# EAGLE design Camera (EAGLE 8.3.2)
COMPANY: ADAFRUIT INDUSTRIES; DRAWN: KTOWN; REV: A
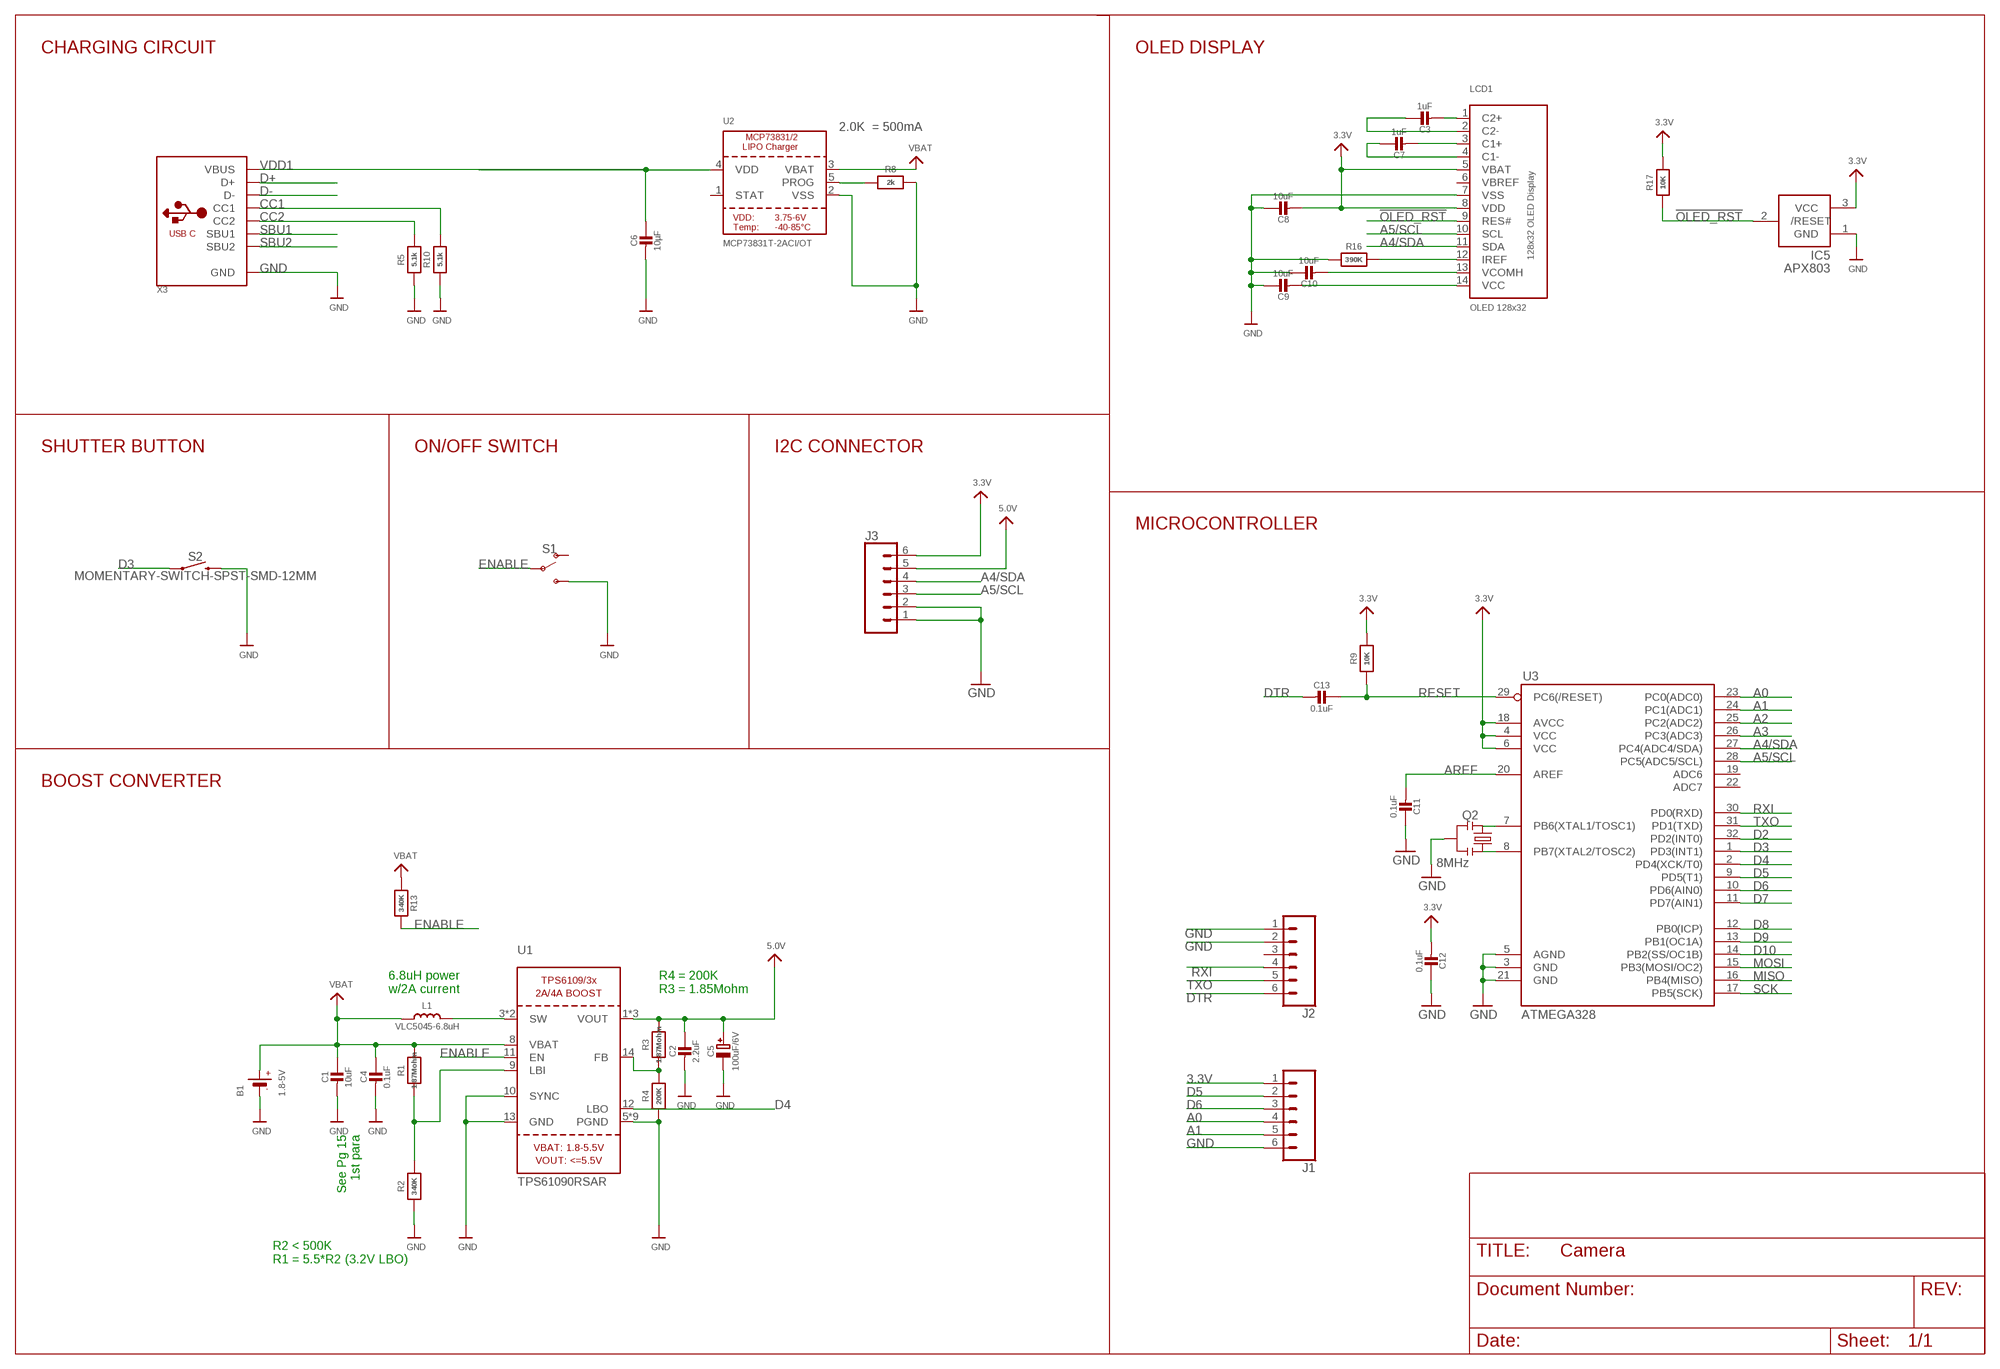
[diagram p0: schematic, sheet 1]

## Parts
B1  1.8-5V  BATTERY  [JSTPH2]
C1  10uF  CAP_CERAMIC0805-NOOUTLINE  [0805-NO]
C2  2.2uF  CAP_CERAMIC0805-NOOUTLINE  [0805-NO]
C3  1uF  CAP_CERAMIC0805-NOOUTLINE  [0805-NO]
C4  0.1uF  CAP_CERAMIC0805-NOOUTLINE  [0805-NO]
C5  100uF/6V  CAP_TANTALUMB/3528_REFLOW  [EIA3528-21/B-R]
C6  10µF  CAP_CERAMIC0805-NOOUTLINE  [0805-NO]
C7  1uF  CAP_CERAMIC0805-NOOUTLINE  [0805-NO]
C8  10uF  CAP_CERAMIC0805-NOOUTLINE  [0805-NO]
C9  10uF  CAP_CERAMIC0805-NOOUTLINE  [0805-NO]
C10  10uF  CAP_CERAMIC0805-NOOUTLINE  [0805-NO]
C11  0.1uF  CAP_CERAMIC0805-NOOUTLINE  [0805-NO]
C12  0.1uF  CAP_CERAMIC0805-NOOUTLINE  [0805-NO]
C13  0.1uF  CAP_CERAMIC0805-NOOUTLINE  [0805-NO]
IC5  APX803  AXP083-SAG  [SOT23]
J1  CONN_06SMD-FEMALE-V2  [1X06-SMD-FEMALE]
J2  CONN_06SMD-FEMALE-V2  [1X06-SMD-FEMALE]
J3  CONN_06SMD-FEMALE-V2  [1X06-SMD-FEMALE]
L1  VLC5045-6.8uH  INDUCTORTDK_VLC5045  [INDUCTOR_5X5MM_TDK_VLC5045]
LCD1  OLED 128x32  DISP_OLED_UG-2832HSWEG02  [UG-2832HSWEG02_WRAPUNDER]
Q2  8MHz  RESONATORSMD  [RESONATOR-SMD]
R1  1.87Mohm  RESISTOR0805_NOOUTLINE  [0805-NO]
R2  340K  RESISTOR0805_NOOUTLINE  [0805-NO]
R3  1.87Mohm  RESISTOR0805_NOOUTLINE  [0805-NO]
R4  200K  RESISTOR0805_NOOUTLINE  [0805-NO]
R5  5.1k  RESISTOR0805_NOOUTLINE  [0805-NO]
R8  2k  RESISTOR0805_NOOUTLINE  [0805-NO]
R9  10K  RESISTOR0805_NOOUTLINE  [0805-NO]
R10  5.1k  RESISTOR0805_NOOUTLINE  [0805-NO]
R13  340K  RESISTOR0805_NOOUTLINE  [0805-NO]
R16  390K  RESISTOR0805_NOOUTLINE  [0805-NO]
R17  10K  RESISTOR0805_NOOUTLINE  [0805-NO]
S1  SWITCH-SPDT-SMD-RIGHT-ANGLE  [SWITCH_SPST_SMD_A]
S2  MOMENTARY-SWITCH-SPST-SMD-12MM  [TACTILE_SWITCH_SMD_12MM]
U1  TPS61090RSAR  VREG_TPS6103X  [PVQFN-16]
U2  MCP73831T-2ACI/OT  MCP73831/2  [SOT23-5]
U3  ATMEGA328  ATMEGA168  [TQFP32-08]
X3  USB_C  [USB_C_CUSB31-CFM2AX-01-X]

## Nets
3.3V: C8.2 C12.2 IC5.3(VCC) J1.1 J3.6 LCD1.5(VBAT) LCD1.8(VDD) R9.2 R17.2 U3.4(VCC) U3.6(VCC) U3.18(AVCC)
5.0V: C2.1 C5.+ J3.5 R3.2 U1.1(VOUT) U1.15(VOUT) U1.16(VOUT)
!OLED_RST: IC5.2(/RESET) LCD1.9(RES#) R17.1
A0: J1.4 U3.23(PC0(ADC0))
A1: J1.5 U3.24(PC1(ADC1))
A2: U3.25(PC2(ADC2))
A3: U3.26(PC3(ADC3))
A4/SDA: J3.4 LCD1.11(SDA) U3.27(PC4(ADC4/SDA))
A5/SCL: J3.3 LCD1.10(SCL) U3.28(PC5(ADC5/SCL))
AREF: C11.2 U3.20(AREF)
CC1: R10.2 X3.A5(CC1)
CC2: R5.2 X3.B5(CC2)
D2: U3.32(PD2(INT0))
D3: S2.1 U3.1(PD3(INT1))
D4: U1.12(LBO) U3.2(PD4(XCK/T0))
D5: J1.2 U3.9(PD5(T1))
D6: J1.3 U3.10(PD6(AIN0))
D7: U3.11(PD7(AIN1))
D8: U3.12(PB0(ICP))
D9: U3.13(PB1(OC1A))
D10: U3.14(PB2(SS/OC1B))
D+: X3.A6(D+) X3.B6(D+)
D-: X3.A7(D-) X3.B7(D-)
DTR: C13.2 J2.6
ENABLE: R13.2 S1.2(P) U1.11(EN)
GND: B1.1(-) C1.2 C2.2 C4.2 C5.- C6.2 C8.1 C9.1 C10.1 C11.1 C12.1 IC5.1(GND) J1.6 J2.1 J2.2 J3.1 J3.2 LCD1.7(VSS) Q2.2 R2.1 R4.1 R5.1 R8.2 R10.1 R16.1 S1.3(S) S2.3 U1.5(PGND) U1.6(PGND) U1.7(PGND) U1.10(SYNC) U1.13(GND) U1.P$18(PGND) U1.P$19(PGND) U1.P$20(PGND) U1.P$21(PGND) U1.P$22(PGND) U1.THERMAL(PGND) U2.2(VSS) U3.3(GND) U3.5(AGND) U3.21(GND) X3.A1B12(GND) X3.B1A12(GND)
MISO: U3.16(PB4(MISO))
MOSI: U3.15(PB3(MOSI/OC2))
N$1: L1.P$2 U1.3(SW) U1.4(SW)
N$3: R1.1 R2.2 U1.9(LBI)
N$5: R3.1 R4.2 U1.14(FB)
N$8: R8.1 U2.5(PROG)
N$11: C3.2 LCD1.1(C2+)
N$12: C3.1 LCD1.2(C2-)
N$13: C7.2 LCD1.3(C1+)
N$14: C7.1 LCD1.4(C1-)
N$15: C10.2 LCD1.13(VCOMH)
N$16: LCD1.12(IREF) R16.2
N$17: C9.2 LCD1.14(VCC)
N$18: Q2.1 U3.8(PB7(XTAL2/TOSC2))
N$19: Q2.3 U3.7(PB6(XTAL1/TOSC1))
RESET: C13.1 R9.1 U3.29(PC6(/RESET))
RXI: J2.4 U3.30(PD0(RXD))
SBU1: X3.A8(SBU1)
SBU2: X3.B8(SBU2)
SCK: U3.17(PB5(SCK))
TXO: J2.5 U3.31(PD1(TXD))
VBAT: B1.2(+) C1.1 C4.1 L1.P$1 R1.2 R13.1 U1.8(VBAT) U2.3(VBAT)
VDD1: C6.1 U2.4(VDD) X3.A4B9(VBUS) X3.B4A9(VBUS)
Unconnected: J2.3 S1.1(O) U2.1(STAT) U3.19(ADC6) U3.22(ADC7)

## Notes on the sheet
- CHARGING CIRCUIT | OLED DISPLAY
- 2.0K  = 500mA
- SHUTTER BUTTON | ON/OFF SWITCH | I2C CONNECTOR
- MICROCONTROLLER
- BOOST CONVERTER
- 6.8uH power
  w/2A current
- R4 = 200K
  R3 = 1.85Mohm
- See Pg 15
  1st para
- R2 < 500K
  R1 = 5.5*R2 (3.2V LBO)

## Power pins joined to a net without a drawn wire
VBREF: LCD1.6(VBREF)

## Library data of the parts
B1 = microbuilder:BATTERY: CR1220 SMT - Digikey: 3001K-ND CD2032 BAT-HLD-001 - Digikey: BAT-HLD-001-ND
C1-C4 C6-C13 = microbuilder:CAP_CERAMIC: Ceramic Capacitors For new designs, use the packages preceded by an '_' character since they are more reliable: The following footprints should be used on most boards: _0402 - Standard footprint for regular board layouts _0603 - Standard footprint for regular board layouts _0805 - Standard footprint for regular board layouts _1206 - Standard footprint for regular board layouts For extremely tight-pitch boards where space is at a premium, the following 'micro-pitch' footprints can be used (smaller pads, no silkscreen outline, etc.): _0402MP - Micro-pitch footprint for very dense/compact boards _0603MP - Micro-pitch footprint for very dense/compact boards _0805MP - Micro-pitch footprint for very dense/compact boards _1206MP - Micro-pitch footprint for very dense/compact boards
C5 = microbuilder:CAP_TANTALUM: Tantalum Capacitors Wave footprints have larger pads and are meant to be used for hand soldering. Reflow footprints are optimised for solder paste and a reflow oven. EIA3216-18/A-[R/W] - Size A / 3216-18 / 1206 footprint 4.7µF 25V 10% Tantalum Capacitor 10µF 16V 10% Tantalum Capacitor [Digikey: 495-2236-2-ND] EIA3528-21/B-[R/W] - Size B / 3528-21 47µF 10V 10% Tantalum Capactior [Digikey: 495-2216-1-ND] EIA6032-28/C-[R/W] - Size C / 6032-28 10µF 35V 20% Tantalum Capacitor [Digikey: 495-2285-1-ND] 100µF 16V 10% Tantalum Capactior [Digikey: 399-5214-1-ND]
IC5 = adafruit:AXP083
J1-J3 = SparkFun-Connectors:CONN_06: Multi connection point. Often used as Generic Header-pin footprint for 0.1 inch spaced/style header connections On any of the 0.1 inch spaced packages, you can populate with these: Break Away Headers - Straight <https://www.sparkfun.com/products/116> (PRT-00116) Break Away Male Headers - Right Angle <https://www.sparkfun.com/products/553> (PRT-00553) Female Headers <https://www.sparkfun.com/products/115> (PRT-00115) Break Away Headers - Machine Pin <https://www.sparkfun.com/products/117> (PRT-00117) Break Away Female Headers - Swiss Machine Pin <https://www.sparkfun.com/products/743> (PRT-00743) Arduino Stackable Header - 6 Pin <https://www.sparkfun.com/products/9280> (PRT-09280) For SCREWTERMINALS and SPRING TERMINALS visit here: Screw Terimnals on SparkFun.com <https://www.sparkfun.com/search/results?term=Screw+Terminals> (5mm/3.5mm/2.54mm spacing) This device is also useful as a general connection point to wire up your design to another part of your project. Our various solder wires solder well into these plated through hole pads. Hook-Up Wire - Assortment (Stranded, 22 AWG) <https://www.sparkfun.com/products/11375> (PRT-11375) Hook-Up Wire - Assortment (Solid Core, 22 AWG) <https://www.sparkfun.com/products/11367> (PRT-11367) View the entire wire category on our website here <https://www.sparkfun.com/categories/141>; PROD_ID: CONN-09668
L1 = microbuilder:INDUCTOR: Inductors 0603: 10nH Ceramic Inductor - microwire antenna/RF (Digikey: 712-1434-2-ND) 0805: 560nH Ceramic Inductor - RF (Digikey: 553-1047-1-ND) 270nH Ceramic Inductor - Q = 40@250MHz, +-5%, 1 Ohm DC Resistance (Digikey: 535-10506-2-ND) 1007 (2518 Metric) SMT: 10µH 10% 250mOhm 820mA 1007 Inductor (Digikey: 587-2189-1-ND) 22µH 10% 500mOhm 580mA 1007 Inductor (Digikey: 587-2190-1-ND) 47µH 10% 950mOhm 420mA 1007 Inductor (Digikey: 587-2191-1-ND) 47µH 5% 100mOhm 1A 1008 Inductor (Digikey: 732-1816-1-ND) 5.0x5.0mm (Taiyo Yuden NR5040 Series) 6.8µH 20% 2.3A 64mOhm Inductor (Digikey: 587-2374-2-ND) 5.0x5.0mm (TDK VLC5045 Series) 4.7µH 20% 3.3A 34mOhm Inductor (Digikey: 445-6526-1-ND) 6.8µH 20% 2.7A 46mOhm Inductor (Digikey: 445-6527-1-ND) 6.0x6.0mm (TDK VLC6045 Series) 4.7µH 20% 3.8A 27mOhm Inductor (Digikey: 445-6538-2-ND) 6.8µH 20% 3A 41mOhm Inductor (Digikey: 445-6540-1-ND) 6.2µH 30% 2.2A 45mOhm Inductor (Digikey: SRR5028-6R2YCT-ND) - Not TDK VLC6045 but footprint should match 6.0x6.0mm (TDK SLF6045 Series) 6.8uH 30% 2A 33mOhm Inductor (Digikey: 445-4572-1-ND, Mouser: 810-SLF645T6R8N2R0PF) 6.0x6.0mm (Sumida CDRH5D28 Series) 6.2uH 30% 1.8A 45mOhm Inductor (Digikey: 308-1542-1-ND) Taiyo Yuden NR3015T2R2M - 2.2uH 20% 1.5A (Digikey: 587-1648-2-ND, Mouser: 963-NR3015T2R2M) - Used with TI TPS62172 CoilCraft RFID Transponder Coil - MA5532-AE (For use with AS3935 Lightning Sensor)
LCD1 = microbuilder:DISP_OLED_UG-2832HSWEG02: 128x32 I2C 0.91" Monochrome OLED Display
Q2 = SparkFun:RESONATOR: Resonator Small SMD resonator. This is the itty bitty 10/20MHz resonators with built in caps. CSTCE10M0G55 and CSTCE20M0V53. Footprint has been reviewed closely but hasn't been tested yet.
R1-R5 R8-R10 R13 R16 R17 = microbuilder:RESISTOR: Resistors For new designs, use the packages preceded by an '_' character since they are more reliable: The following footprints should be used on most boards: _0402 - Standard footprint for regular board layouts _0603 - Standard footprint for regular board layouts _0805 - Standard footprint for regular board layouts _1206 - Standard footprint for regular board layouts For extremely tight-pitch boards where space is at a premium, the following 'micro-pitch' footprints can be used (smaller pads, no silkscreen outline, etc.): _0402MP - Micro-pitch footprint for very dense/compact boards _0603MP - Micro-pitch footprint for very dense/compact boards _0805MP - Micro-pitch footprint for very dense/compact boards _1206MP - Micro-pitch footprint for very dense/compact boards
S1 = SparkFun-Switches:SWITCH-SPDT: Single Pole, Double Throw (SPDT) Switch Single-pole, double-throw (SPDT) switch. Variant Overview SMD-AYZ0202 Surface Mount DPDT Switch <https://www.sparkfun.com/products/597> (COM-00597) Used on e.g. LilyPad Arduino USB - ATmega32U4 Board <https://www.sparkfun.com/products/12049> PTH-11.6X4.0MM SPDT Mini Power Switch <https://www.sparkfun.com/products/102> (COM-00102) Used on e.g. SparkFun Simon Says - Through-Hole Soldering Kit <https://www.sparkfun.com/products/10547> (KIT-10547) PTH-11.6X4.0MM-KIT KIT version of SPDT Mini Power Switch - Simplifies soldering by removing tStop of switch pins - only one side can be soldered. PTH-11.6X4.0MM-LOCK LOCK version of SPDT Mini Power Switch - Offset pins hold switch in place for easier soldering. SMD-RIGHT-ANGLE Surface Mount Right Angle Switch <https://www.sparkfun.com/products/10860> (COM-10860) Used on e.g. SparkFun ESP8266 Thing <https://www.sparkfun.com/products/13231>; PROD_ID: SWCH-10651; SF_SKU: COM-10860
S2 = SparkFun-Switches:MOMENTARY-SWITCH-SPST: Momentary Switch (Pushbutton) - SPST Normally-open (NO) SPST momentary switches (buttons, pushbuttons). Variants PTH-12MM - 12mm square, through-hole Momentary Pushbutton Switch - 12mm Square <https://www.sparkfun.com/products/9190> (COM-09190) PTH-6.0MM, PTH-6.0MM-KIT - 6.0mm square, through-hole Mini Pushbutton Switch <https://www.sparkfun.com/products/97> (COM-00097) KIT package intended for soldering kit's - only one side of pads' copper is exposed. PTH-RIGHT-ANGLE-KIT - Right-angle, through-hole Right Angle Tactile Button <https://www.sparkfun.com/products/10791> - Used on SparkFun BigTime Watch Kit <https://www.sparkfun.com/products/11734> SMD-12MM - 12mm square, surface-mount Tactile Button - SMD (12mm) <https://www.sparkfun.com/products/12993> (COM-12993) Used on SparkFun PicoBoard <https://www.sparkfun.com/products/11888> SMD-4.5MM - 4.5mm Square Trackball Switch Used on SparkFun Blackberry Trackballer Breakout <https://www.sparkfun.com/products/13169> SMD-4.6MMX2.8MM - 4.60mm x 2.80mm, surface mount Used on SparkFun SAMD21 Mini Breakout <https://www.sparkfun.com/products/13664> SMD-5.2MM, SMD-5.2-REDUNDANT - 5.2mm square, surface-mount Mini Pushbutton Switch - SMD <https://www.sparkfun.com/products/8720> (COM-08720) Used on Arduino Pro Mini <https://www.sparkfun.com/products/11114> REDUNDANT package connects both switch circuits together SMD-6.0X3.5MM - 6.0 x 3.5mm, surface mount Momentary Reset Switch SMD <https://www.sparkfun.com/products/8229> (COM-08229) SMD-6.2MM-TALL - 6.2mm square, surface mount Tactile Button - SMD (6mm) <https://www.sparkfun.com/products/12992> Used on SparkFun Digital Sandbox <https://www.sparkfun.com/products/12651> SMD-RIGHT-ANGLE - Right-angle, surface mount Used on SparkFun Block for Intel® Edison - Arduino <https://www.sparkfun.com/products/13036>; PROD_ID: SWCH-11967; SF_SKU: COM-12993
U1 = microbuilder:VREG_TPS6103X: TPS6103x 4A Boost - 1.8-5.5V Input, Adjustable Output to 5.5V
U2 = microbuilder:MCP73831/2: MCP73831/2 LIPO Charger VDD: 3.75 - 6V Temp -40 - 85°C Programmable Charge Rate: 15-500mA NOTE: STAT is a tri-state logic output on the MCP73831 and an open-drain output on the MCP73832. SOT23-5 with 4.2V output and tri-state logic on STAT = MCP73831T-2ACI/OT
U3 = SparkFun:ATMEGA168
X3 = microbuilder:USB_C: USB Type-C USB 2.0 Connector

## Net classes
0 default: width 0.203 mm
1 vcc: width 0.254 mm

## Board
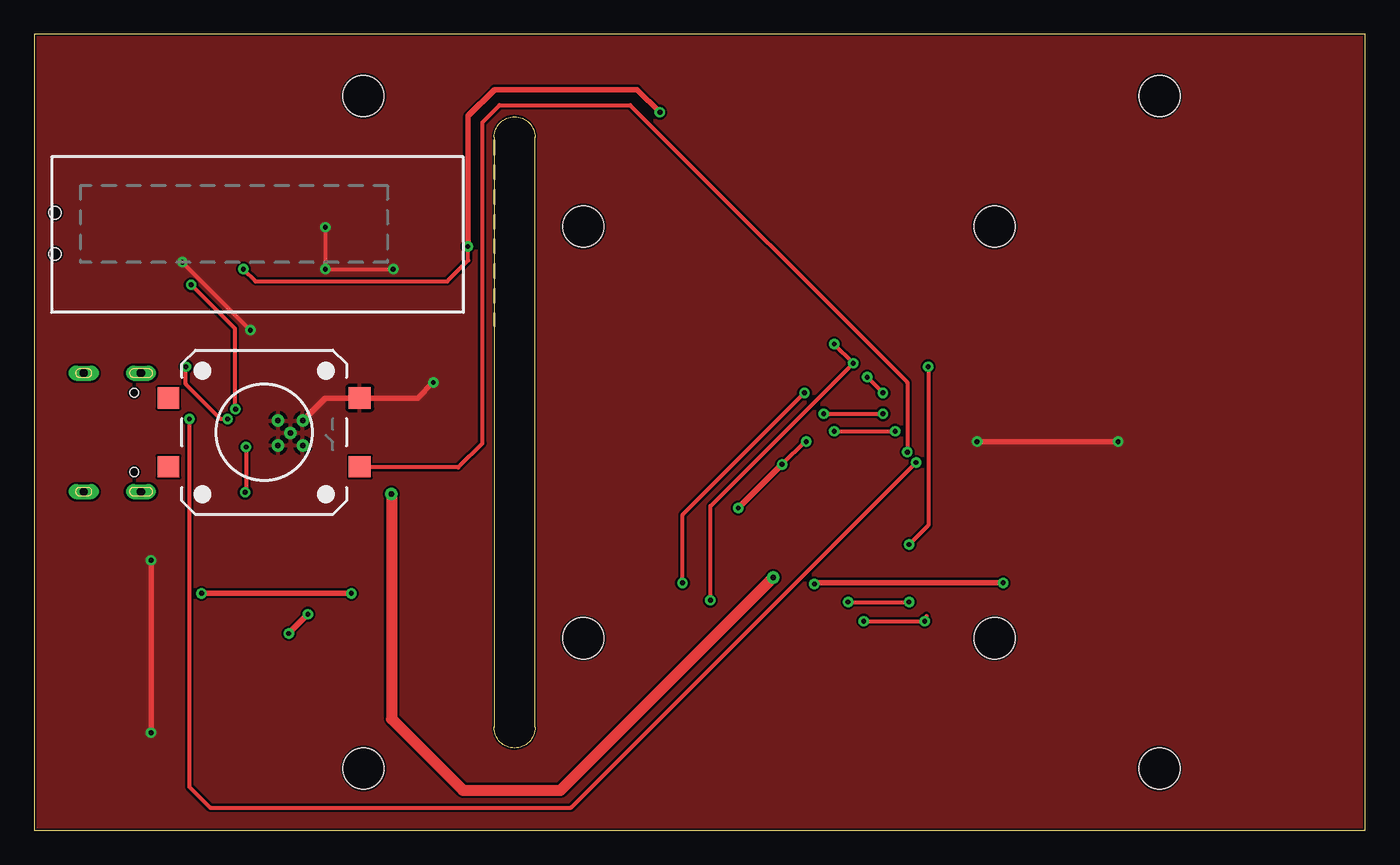
[diagram p1: board, top side]
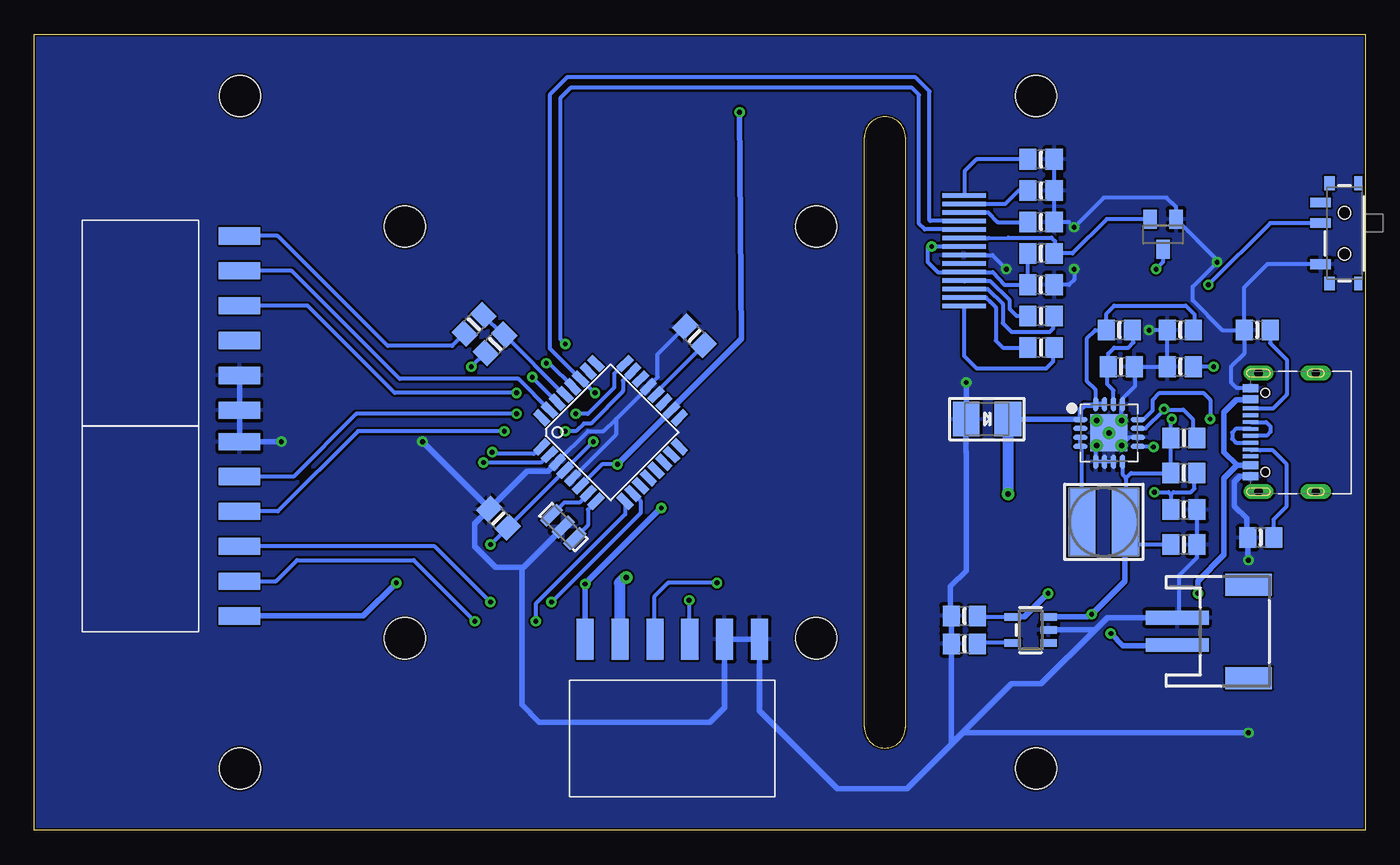
[diagram p2: board, bottom side, seen from below]

Size 97 x 58 mm. Coordinates in mm from the lower left corner, seen from the top.
Outline: 0,0 97,0 97,58 0,58 0,0
Outline: 33.5,50.5 33.5,7.5 arc180 36.5,7.5 36.5,50.5 arc180 33.5,50.5
Copper layers (1*16): Top 0.035mm / dielectric 1.5mm / Bottom 0.035mm
Design rules "default *": minimum track width 6mil, minimum drill 0.3mm, track to track 6mil, track to pad 6mil, pad to pad 6mil, via to via 6mil, smd to smd 6mil, copper to edge 6mil, drill to drill 6mil, minimum pad ring 10mil, minimum via ring 8mil, stop-mask expansion 4mil, vias tented up to drill 0mil, thermal gap 10mil
Holes 3 mm at 24,53.5 82,53.5 24,4.5 82,4.5 70,44 40,44 40,14 70,14

### Footprints (pad centres in the part's own frame; a part is rotated, then mirrored left to right if it is on the bottom)
JSTPH2 = smd 1 x 4.6: 1 -1,-3.7; 2 1,-3.7 | smd 1.6 x 3.4: NC1 -3.4,1.5; NC2 3.4,1.5
0805-NO = smd 1.24 x 1.5: 1 -0.95,0; 2 0.95,0
EIA3528-21/B-R = smd 1.95 x 2.5: + 1.525,0; - -1.525,0
SOT23 = smd 1 x 1.4: 1 -0.95,-1.1; 2 0.95,-1.1; 3 0,1.1
1X06-SMD-FEMALE = smd 1.25 x 3: 1 6.35,3.425; 2 3.81,3.425; 3 1.27,3.425; 4 -1.27,3.425; 5 -3.81,3.425; 6 -6.35,3.425
INDUCTOR_5X5MM_TDK_VLC5045 = smd 2 x 5: P$1 -1.6,0; P$2 1.6,0
UG-2832HSWEG02_WRAPUNDER = smd 3.2 x 0.35 bottom: 1 -2.03,-5.3; 2 -2.03,-4.68; 3 -2.03,-4.06; 4 -2.03,-3.44; 5 -2.03,-2.82; 6 -2.03,-2.2; 7 -2.03,-1.58; 8 -2.03,-0.96; 9 -2.03,-0.34; 10 -2.03,0.28; 11 -2.03,0.9; 12 -2.03,1.52; 13 -2.03,2.14; 14 -2.03,2.76
RESONATOR-SMD = smd 0.7 x 1.7: 1 -1.2,0; 2 0,0; 3 1.2,0
SWITCH_SPST_SMD_A = smd 0.7 x 1.5: 1 -2.25,-1.75; 2 -0.75,-1.75; 3 2.25,-1.75 | smd 1 x 0.6: GND1 -3.65,1; GND3 3.65,1 | smd 1 x 0.8: GND2 -3.65,-1.1; GND4 3.65,-1.1 | hole 0.9: -1.5,0; 1.5,0
TACTILE_SWITCH_SMD_12MM = smd 1.6 x 1.55: 1 6.975,-2.5; 2 -6.975,-2.5; 3 6.975,2.5; 4 -6.975,2.5
PVQFN-16 = smd 1.05 x 0.35: 1 -2.1,0.975; 2 -2.1,0.325; 3 -2.1,-0.325; 4 -2.1,-0.975; 9 2.1,-0.975; 10 2.1,-0.325; 11 2.1,0.325; 12 2.1,0.975 | smd 0.35 x 1.05: 5 -0.975,-2.1; 6 -0.325,-2.1; 7 0.325,-2.1; 8 0.975,-2.1; 13 0.975,2.1; 14 0.325,2.1; 15 -0.325,2.1; 16 -0.975,2.1 | drill 0.4: P$18 0,0; P$19 -0.9,0.9; P$20 0.9,0.9; P$21 0.9,-0.9; P$22 -0.9,-0.9 | smd 2.7 x 2.7: THERMAL 0,0
SOT23-5 = smd 0.55 x 1.2: 1 -0.95,-1.3; 2 0,-1.3; 3 0.95,-1.3; 4 0.95,1.3; 5 -0.95,1.3
TQFP32-08 = smd 1.27 x 0.559: 1 -4.293,2.8; 2 -4.293,2; 3 -4.293,1.2; 4 -4.293,0.4; 5 -4.293,-0.4; 6 -4.293,-1.2; 7 -4.293,-2; 8 -4.293,-2.8; 17 4.293,-2.8; 18 4.293,-2; 19 4.293,-1.2; 20 4.293,-0.4; 21 4.293,0.4; 22 4.293,1.2; 23 4.293,2; 24 4.293,2.8 | smd 0.559 x 1.27: 9 -2.8,-4.293; 10 -2,-4.293; 11 -1.2,-4.293; 12 -0.4,-4.293; 13 0.4,-4.293; 14 1.2,-4.293; 15 2,-4.293; 16 2.8,-4.293; 25 2.8,4.293; 26 2,4.293; 27 1.2,4.293; 28 0.4,4.293; 29 -0.4,4.293; 30 -1.2,4.293; 31 -2,4.293; 32 -2.8,4.293
USB_C_CUSB31-CFM2AX-01-X = smd 0.575 x 1.15: A1B12 -3.2,7.355; A4B9 -2.4,7.355; B1A12 3.2,7.355; B4A9 2.4,7.355 | smd 0.275 x 1.15: A5 -1.25,7.355; A6 -0.25,7.355; A7 0.25,7.355; A8 1.25,7.355; B5 1.75,7.355; B6 0.75,7.355; B7 -0.75,7.355; B8 -1.75,7.355 | drill 0.6 pad 1 long: M1 -4.32,6.78; M2 4.32,6.78; M3 -4.32,2.6; M4 4.32,2.6 | hole 0.65: 2.89,6.28; -2.89,6.28

### Placement (x,y rotation side)
B1  10,14.5 270 bottom
C1  13.46,33.78 180 bottom
C2  13.46,36.45 180 bottom
C3  23.62,35.18 0 bottom
C4  13.21,20.83 0 bottom
C5  27.56,29.97 0 bottom
C6  29.21,15.62 180 bottom
C7  23.62,37.47 0 bottom
C8  23.62,39.75 180 bottom
C9  23.62,48.9 180 bottom
C10  23.62,46.61 180 bottom
C11  48.89,36.03 315 bottom
C12  63.17,22.74 315 bottom
C13  64.96,36.88 225 bottom
IC5  14.73,43.43 180 bottom
J1  85.47,21.97 270 bottom
J2  85.47,36.96 270 bottom
J3  50.5,10.5 0 bottom
L1  19.05,22.48 180 bottom
LCD1  31.26,43.5 0 top
Q2  58.46,22.11 135 bottom
R1  13.21,26.04 180 bottom
R2  13.21,23.37 180 bottom
R3  17.91,36.45 180 bottom
R4  17.78,33.78 180 bottom
R5  7.87,36.45 0 bottom
R8  29.21,13.59 180 bottom
R9  63.41,35.44 225 bottom
R10  7.62,21.34 0 bottom
R13  13.21,28.57 0 bottom
R16  23.62,44.32 180 bottom
R17  23.62,42.04 180 bottom
S1  1.5,43.5 270 bottom
S2  16.75,29 0 top
U1  18.67,28.96 0 bottom
U2  24.38,14.61 90 bottom
U3  55,29 45 bottom
U$9  [PHOENIX_LOGO]  92.83,2.94 90 top
X3  1,29 90 bottom

### Tracks (layer width: path | path; a pad name or v marks a point on that pad's centre or on a via)
3.3V  (via drill 0.35)
  Top 0.305: v51.31,23.5 51.33,23.5 | v56.26,28.32 56.15,28.32 v54.5,26.67 | v65.15,33.78 65.15,22.23 v63.75,20.83 | v31.6,42.55 31.62,42.42 31.62,41.53 30.1,40.01 16.13,40.01 v15.24,40.89
  Top 0.406: v54.5,26.67 51.33,23.5 | v45.59,52.32 43.94,53.98 33.53,53.98 31.62,52.07 31.62,42.42 | v70.61,18.03 57.06,18.03 v56.85,17.95
  Bottom 0.305: U3.6 55.63,26.67 v54.5,26.67 | v56.26,28.32 58.32,26.26 U3.4 C12.2 63.73,20.83 v63.75,20.83 | R9.2 64.16,34.77 v65.15,33.78 | U3.18 50.55,30.73 | LCD1.8 v31.6,42.55 31.88,42.52 31.88,41.4 31.16,40.68 LCD1.5 27.14,40.68 26.29,39.75 C8.2 R17.2 | IC5.3 14.73,41.4 v15.24,40.89
  Bottom 0.406: v54.5,26.67 U3.18 | 50.55,30.73 45.47,35.81 v45.59,52.32 | J3.6 v56.85,17.95 v51.31,23.5 | J1.1 73.03,15.62 v70.61,18.03
5.0V  (via drill 0.4 pad 0.9)
  Top 0.813: v26.04,24.51 26.04,8.13 31.24,2.92 38.35,2.92 v53.85,18.41
  Bottom 0.305: U1.16 19.68,31.1 19.68,32.13 20.32,32.77 20.32,35.81 19.68,36.45 R3.2 18.86,37.66 18.29,38.23 13.08,38.23 12.45,37.59 12.45,36.52 C2.1
  Bottom 0.406: C5.+ 20.81,29.97 U1.1 20.77,30.67 20.45,30.99 19.71,30.99 U1.16 U1.15 | v26.03,24.51 v26.04,24.51 | 54.36,13.97 J3.5
  Bottom 0.813: C5.+ v26.03,24.51 | v53.85,18.41 53.98,18.41 54.36,18.03 54.36,13.97
!OLED_RST
  Bottom 0.305: LCD1.9 27.45,43.16 26.04,43.18 22.86,43.18 22.61,42.93 22.61,42.1 R17.1 21.34,42.04 18.84,44.53 IC5.2
A0  (via drill 0.35)
  Top 0.305: v58.29,29.08 v62.74,29.08
  Bottom 0.305: U3.23 53.42,33.45 54.1,32.77 54.1,32 56.44,29.64 56.95,29.64 57.53,29.08 v58.29,29.08 | v62.74,29.08 73.41,29.08 79.25,23.24 J1.4
A1  (via drill 0.35)
  Top 0.305: v57.53,30.35 v61.85,30.35
  Bottom 0.305: U3.24 54,34.02 54.74,33.27 54.74,32.26 56.64,30.35 v57.53,30.35 | v61.85,30.35 73.53,30.35 78.11,25.78 J1.5
A4/SDA  (via drill 0.35)
  Top 0.305: v47.24,18.03 47.24,22.99 v56.13,31.88
  Bottom 0.305: LCD1.11 31.7,44.4 31.75,44.45 31.75,53.85 32.77,54.86 58.17,54.86 59.44,53.59 59.44,35.13 U3.27 56.18,31.88 v56.13,31.88 | v47.24,18.03 50.8,18.03 51.82,17.02 51.82,13.97 J3.4
A5/SCL  (via drill 0.35)
  Top 0.305: v58.29,35.43 v59.69,34.04 49.28,23.62 v49.28,16.76
  Bottom 0.305: LCD1.10 32.1,43.78 32.51,44.2 32.51,53.59 33.02,54.1 57.91,54.1 58.67,53.34 58.67,35.81 v58.29,35.43 | v59.69,34.04 59.47,34.04 U3.28 | J3.3 49.23,16.72 v49.28,16.76
AREF
  Bottom 0.305: U3.20 51.68,31.89 C11.2
CC1
  Bottom 0.305: R10.2 6.67,22.67 5.71,23.62 5.71,26.67 6.73,27.69 7.65,27.69 8.3,27.69 X3.A5
CC2
  Bottom 0.305: R5.2 6.92,35.5 5.71,34.29 5.71,31.75 6.73,30.73 8.34,30.73 X3.B5
D3  (via drill 0.35)
  Top 0.305: S2.1 24.18,26.45 30.89,26.45 32.66,28.22 32.64,28.24 32.64,51.56 33.91,52.83 43.43,52.83 63.63,32.64 v63.63,27.56
  Bottom 0.305: U3.1 60.07,27.95 60.58,27.43 63.5,27.43 v63.63,27.56
D4  (via drill 0.35)
  Top 0.305: v11.3,29.97 11.3,3.17 12.83,1.65 39.12,1.65 v64.26,26.8
  Bottom 0.305: U3.2 59.49,27.38 60.07,26.8 v64.26,26.8 | 11.52,29.93 11.43,29.84 v11.3,29.97 11.3,31.37 11.81,31.88 14.99,31.88 15.49,31.37 15.49,30.61 16.17,29.93 U1.12
D5  (via drill 0.35)
  Top 0.305: v60.45,15.24 v64.9,15.24 65.02,15.62
  Bottom 0.305: U3.9 53.95,23.02 60.45,16.51 v60.45,15.24 | J1.2 79.38,18.16 77.85,19.68 69.34,19.68 v64.9,15.24
D6  (via drill 0.35)
  Top 0.305: v59.31,16.64 v63.75,16.64
  Bottom 0.305: U3.10 | U3.10 52.83,24 52.83,23.11 v59.31,16.64 | v63.75,16.64 67.82,20.7 J1.3
D+
  Bottom 0.305: X3.B6 7.22,29.75 6.91,29.44 6.91,29.03 7.19,28.75 X3.A6
D-
  Bottom 0.305: X3.A7 9.43,29.25 9.7,28.98 9.7,28.52 9.42,28.25 X3.B7
DTR
  Bottom 0.305: C13.2 65.65,36.2 66.55,35.31 71.25,35.31 79.25,43.31 J2.6
ENABLE  (via drill 0.35)
  Top 0.305: v11.43,39.75 14.61,36.58 14.61,30.75 v14.67,30.69
  Bottom 0.305: R13.2 12.57,28.64 12.57,29.97 13.26,30.66 14.63,30.66 14.67,30.62 | U1.11 16.01,29.28 14.71,30.58 14.67,30.62 | S1.2 6.93,44.25 v11.43,39.75 | v14.67,30.69 14.67,30.62
GND  (via drill 0.35)
  Top 0.305: 21.34,40.89 v26.16,40.89 | 21.34,40.89 v21.21,40.89 | v21.21,43.94 21.21,41.02 21.34,40.89 | v15.75,36.45 v10.79,41.4
  Top 0.406: v8.51,19.68 v8.51,7.11 | U1.P$19 21.21,31.5 S2.3 27.94,31.5 v29.08,32.64 | v68.71,28.32 v78.99,28.32
  Bottom 0.305: 58.91,26.81 U3.3 58.88,26.84 56.64,29.08 55.52,29.08 54.61,29.96 | C12.1 63.84,23.45 | Q2.2 58.45,22.06 | 61.47,19.18 61.34,19.18 | U3.5 54.61,28.83 54.61,29.96 | 54.61,29.96 U3.21 52.25,32.33 51.56,33.02 51.56,34.7 C11.1 | LCD1.7 27.17,41.92 v26.16,40.89 | v21.21,40.89 21.21,40.13 21.59,39.75 C8.1 | C9.1 C10.1 R16.1 21.59,44.32 v21.21,43.94 19.05,46.1 14.48,46.1 13.78,45.41 IC5.1 10.79,41.55 v10.79,41.4 12.57,39.62 12.57,38.61 10.41,36.45 R5.1 | 30.16,6.29 29.97,6.48 28.19,8.26 | R2.1 C4.2 12.26,19.87 13.59,18.54 13.59,15.61 B1.1 | U1.10 17.19,28.63 U1.P$21 U1.THERMAL | U1.THERMAL U1.P$22 19.64,27.98 U1.5 U1.6 U1.7 | U1.THERMAL U1.P$20 17.77,30.98 U1.13 17.69,31.45 16.76,32.38 16.76,33.72 R4.1 C1.2 C2.2 v15.75,36.45 | U1.THERMAL U1.P$19 | R5.1 8.82,39.56 7.11,41.27 3.27,41.27 S1.3 | R5.1 8.82,34.74 9.78,33.78 9.78,32.64 9.4,32.26 8.41,32.26 X3.B1A12
  Bottom 0.406: 58.91,26.81 59.56,26.16 61.09,26.16 C12.1 64.9,22.35 64.9,20.7 63.37,19.18 61.47,19.18 61.47,9.14 60.2,7.87 47.75,7.87 46.69,8.94 J3.2 J3.1 44.15,8.72 38.48,3.05 33.4,3.05 30.16,6.29 | 61.34,19.18 58.45,22.06 | 30.16,6.29 R8.2 C6.2 30.23,15.69 30.23,17.78 29.08,18.92 29.08,27.56 C5.- v29.08,32.64 | 19.68,14.61 18.8,15.49 B1.1 | U2.2 19.68,14.61 | 29.97,6.48 25.78,10.67 23.62,10.67 19.68,14.61 | X3.A1B12 9.12,25.8 9.53,25.4 9.53,23.62 8.64,22.73 8.64,21.4 R10.1 8.57,19.75 8.64,19.68 v8.51,19.68 | v8.51,7.11 29.34,7.11 30.16,6.29 | v78.99,28.32 J1.6 J2.1 J2.2 | 63.84,23.45 v68.71,28.32
  pour Bottom: 97.28,57.91 97.28,0.25 97.41,0.13 0.25,0.13 0.13,0 -0.13,58.04
  pour Top: 96.77,58.17 97.03,57.91 97.03,0 0,0 0,57.91
N$1
  Bottom 0.305: U1.3 U1.4 20.65,27.86 L1.P$2
N$3  (via drill 0.35)
  Top 0.305: v15.44,27.94 15.44,24.57 15.37,24.77 v15.37,24.64
  Bottom 0.305: 14.16,24.45 R2.2 | 14.16,24.45 13.97,24.64 12.7,24.64 12.45,24.89 12.45,25.97 R1.1 | U1.9 15.66,27.98 15.62,27.94 v15.44,27.94 | v15.37,24.64 14.35,24.64 14.16,24.45
N$5
  Bottom 0.305: U1.14 18.34,32.06 18.8,32.51 18.8,33.72 R4.2 18.73,34.74 18.29,35.18 17.27,35.18 16.89,35.56 16.89,36.38 R3.1
N$8
  Bottom 0.305: U2.5 28.19,13.65 R8.1
N$11
  Bottom 0.305: LCD1.1 29.23,34.56 28.32,33.66 23.24,33.66 22.73,34.16 22.73,35.12 C3.2
N$12
  Bottom 0.305: 27.32,38.5 | 27.32,38.5 26.92,38.1 26.92,35.69 26.42,35.18 C3.1 | LCD1.2 27.64,38.82 27.32,38.5
N$13
  Bottom 0.305: C7.2 22.73,37.4 22.73,36.58 22.99,36.32 25.78,36.32 26.42,36.96 26.42,38.35 27.5,39.44 LCD1.3
N$14
  Bottom 0.305: LCD1.4 29.18,40.01 27.3,40.01 25.91,38.61 25.91,37.97 25.4,37.47 C7.1
N$15
  Bottom 0.305: LCD1.13 26.24,45.64 25.27,46.61 C10.2
N$16
  Bottom 0.305: LCD1.12 27.5,45.02 26.8,44.32 R16.2
N$17
  Bottom 0.305: C9.2 28.32,48.9 29.21,48.01 29.21,46.28 LCD1.14
N$18
  Bottom 0.305: U3.8 56.05,23.95 56.64,23.37 56.64,22.23 Q2.1
N$19
  Bottom 0.305: U3.7 56.62,24.53 57.28,23.88 58.39,23.88 Q2.3
RESET
  Bottom 0.305: U3.29 58.38,31.75 R9.1 62.85,36.11 C13.1
RXI  (via drill 0.35)
  Top 0.305: v60.71,33.02 v61.85,31.88
  Bottom 0.305: U3.30 v60.71,33.02 | v61.85,31.88 70.74,31.88 77.09,38.23 J2.4
TXO
  Bottom 0.305: U3.31 | U3.31 61.72,32.89 70.36,32.89 78.23,40.77 J2.5
VBAT  (via drill 0.35)
  Top 0.305: v14.1,29.97 13.59,29.97 11.05,32.51 v11.05,33.78
  Top 0.406: v19.94,15.75 v18.54,14.35
  Bottom 0.305: C4.1 17.4,20.83 17.53,20.95 | 17.45,25.65 L1.P$1 | 17.45,25.65 17.45,25.7 17.65,25.91 17.65,26.82 U1.8 | 17.45,25.65 17.07,26.04 R1.2 R13.1 14.16,29.91 v14.1,29.97 | v11.05,33.78 C1.1
  Bottom 0.406: U2.3 20.26,15.55 20.07,15.75 v19.94,15.75 17.53,18.16 17.53,20.95 17.53,22.4 L1.P$1 | v18.54,14.35 17.65,13.46 13.74,13.46 B1.2
VDD1  (via drill 0.35)
  Top 0.406: v23.11,17.27 v12.19,17.27
  Bottom 0.305: U2.4 28.19,15.55 C6.1
  Bottom 0.406: 12.19,17.14 v12.19,17.27 12.19,18.16 10.29,20.07 10.29,25.65 9.34,26.6 X3.A4B9 9.33,26.6 10.29,27.56 10.29,30.48 9.4,31.37 8.39,31.37 X3.B4A9 | U2.4 24.83,15.55 v23.11,17.27